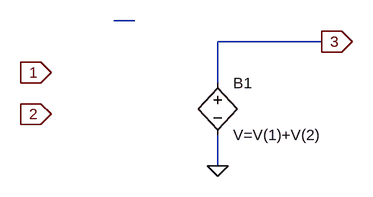
[diagram p0: schematic adder.asc]
adder.asc, the LTspice schematic file:
Version 4
SHEET 1 880 680
WIRE 80 48 48 48
WIRE 368 80 208 80
WIRE 208 144 208 80
WIRE 208 272 208 224
FLAG -48 128 1
IOPIN -48 128 In
FLAG -48 192 2
IOPIN -48 192 In
FLAG 208 272 0
FLAG 368 80 3
IOPIN 368 80 Out
SYMBOL bv 208 128 R0
SYMATTR InstName B1
SYMATTR Value V=V(1)+V(2)

The netlist it stands for:
* adder.asc
B1 3 0 V=V(1)+V(2)
.backanno
.end